# Altium schematic sheet AudioAmplifier.SchDoc
size A3
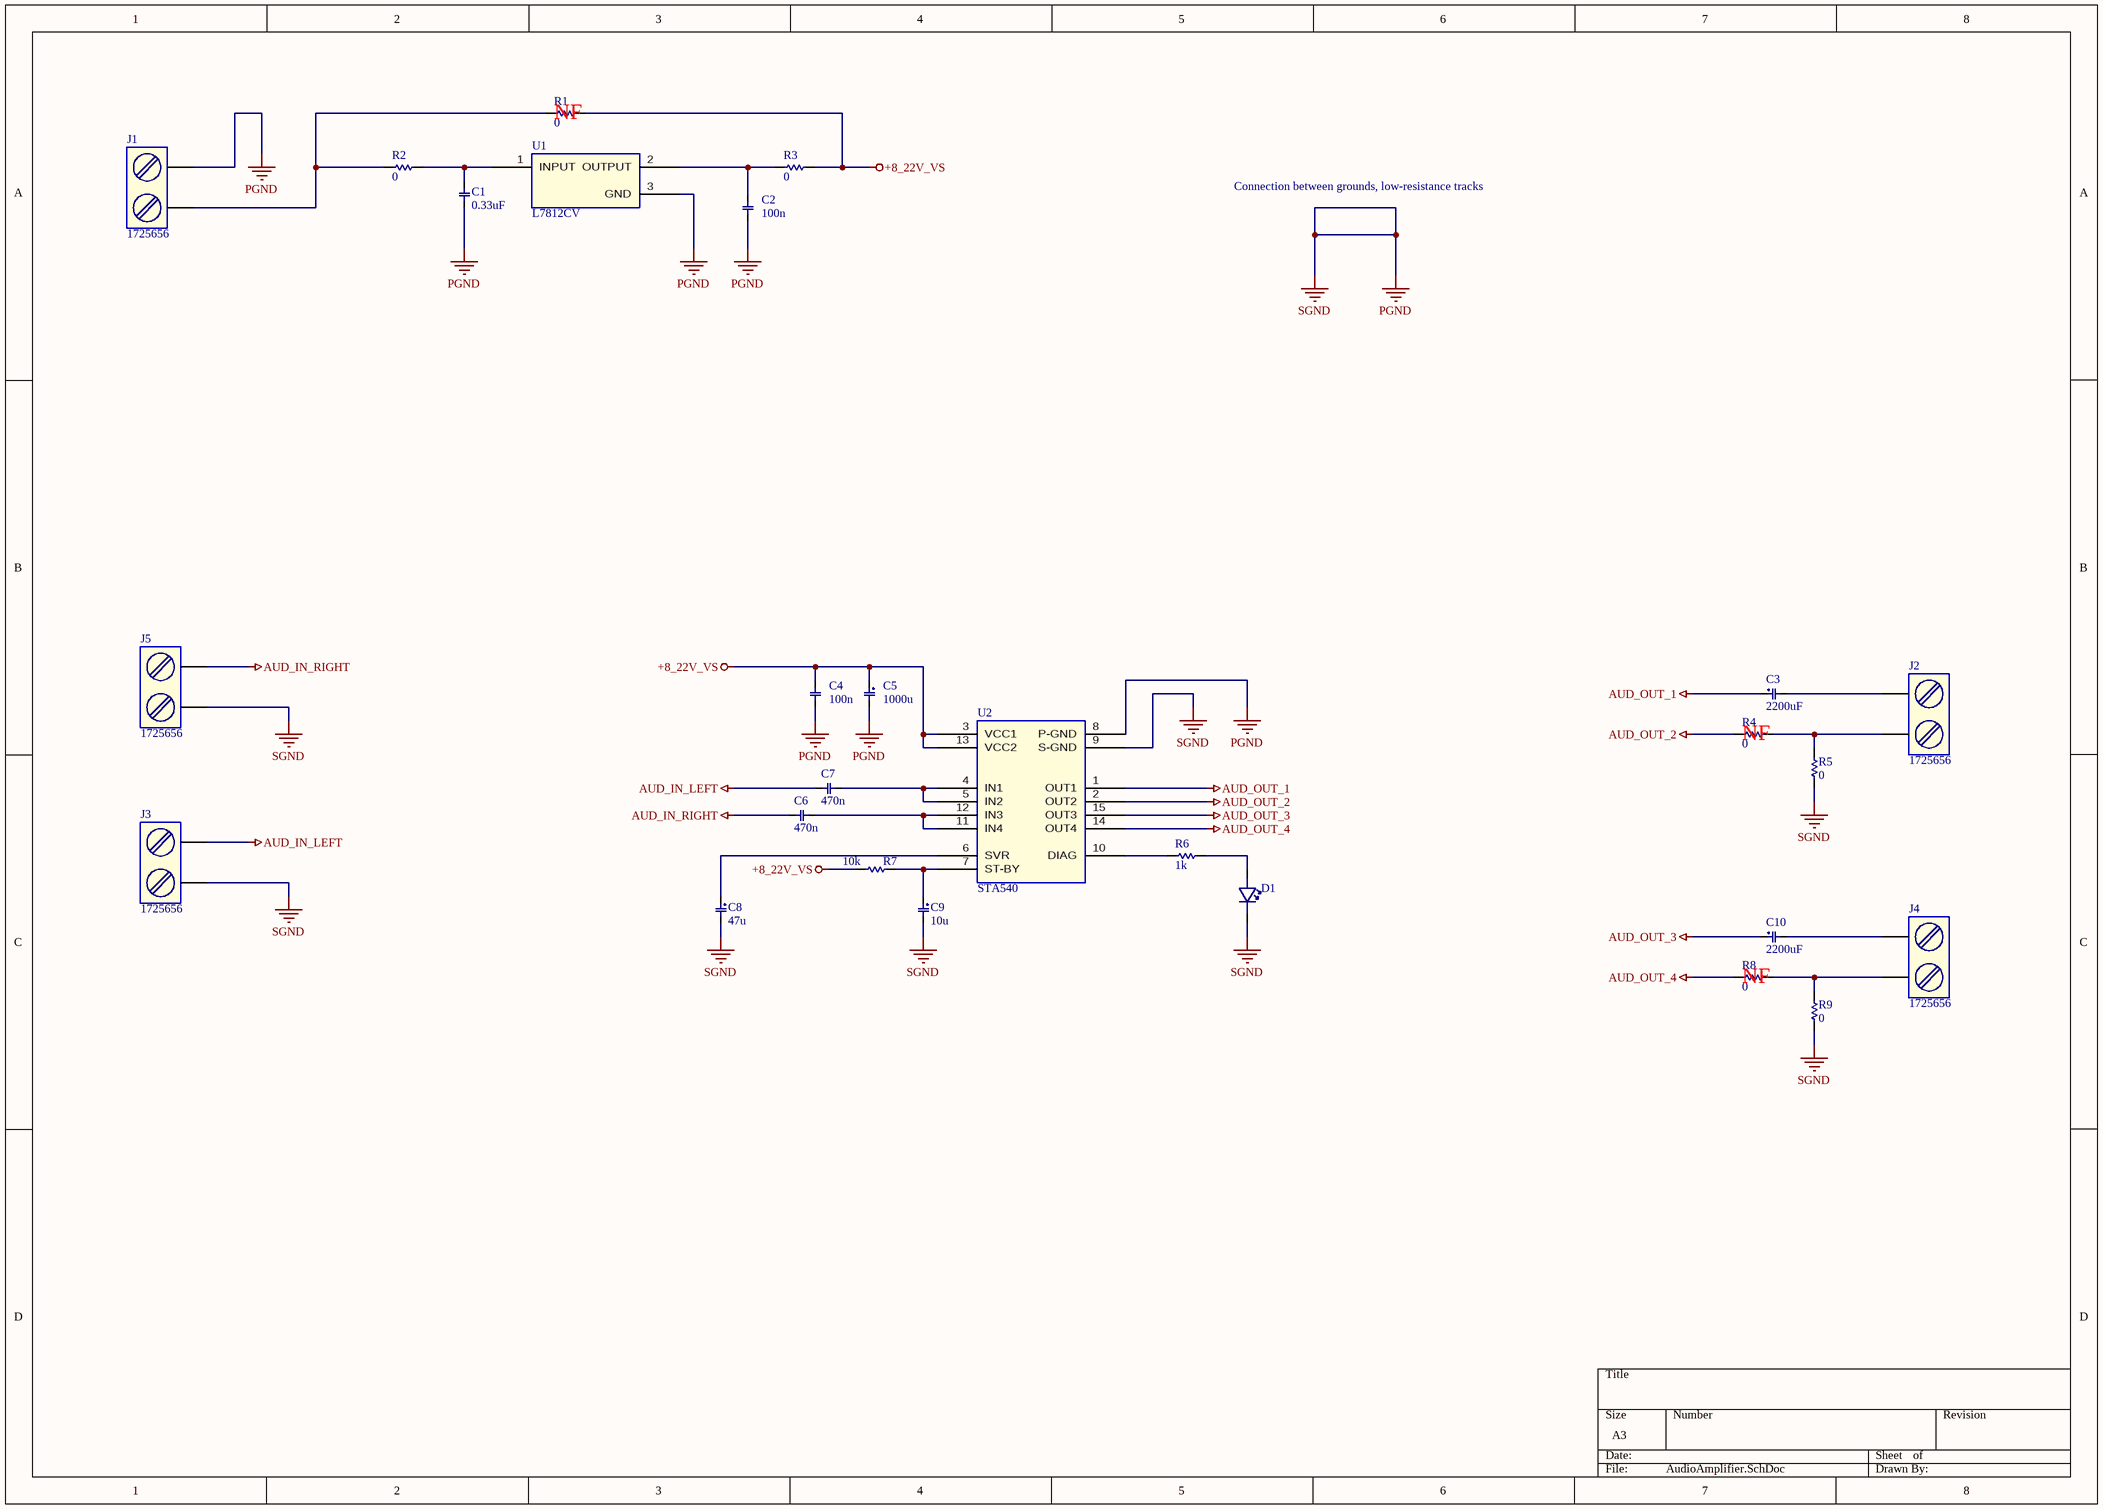
[diagram p0: AudioAmplifier.SchDoc]

## Parts
C1  0.33uF  [CERAMIC CAPACITOR]
C2  100n  [CERAMIC CAPACITOR]
C3  2200uF  [ELECTROLYTIC_CAPACITOR]
C4  100n  [CERAMIC CAPACITOR]
C5  1000u  [ELECTROLYTIC_CAPACITOR]
C6  470n  [CERAMIC CAPACITOR]
C7  470n  [CERAMIC CAPACITOR]
C8  47u  [ELECTROLYTIC_CAPACITOR]
C9  10u  [ELECTROLYTIC_CAPACITOR]
C10  2200uF  [ELECTROLYTIC_CAPACITOR]
D1  350-00006  [LED]  (value not drawn)
J1  1725656  [1725656]
J2  1725656  [1725656]
J3  1725656  [1725656]
J4  1725656  [1725656]
J5  1725656  [1725656]
R1  0  [Resistor]
R2  0  [Resistor]
R3  0  [Resistor]
R4  0  [Resistor]
R5  0  [Resistor]
R6  1k  [Resistor]
R7  10k  [Resistor]
R8  0  [Resistor]
R9  0  [Resistor]
U1  L7812CV  [TO-220]
U2  STA540  [Multiwatt15]

## Nets
+8_22V_VS: C4.1 C5.1 R1.2 R3.2 R7.1 U2.3(VCC1) U2.13(VCC2)
AUD_IN_LEFT: C7.1 J3.2
AUD_IN_RIGHT: C6.1 J5.2
AUD_OUT_1: C3.1 U2.1(OUT1)
AUD_OUT_2: R4.1 U2.2(OUT2)
AUD_OUT_3: C10.1 U2.15(OUT3)
AUD_OUT_4: R8.1 U2.14(OUT4)
PGND: C1.1 C2.2 C4.2 C5.2 C8.2 C9.2 D1.2 J1.2 J3.1 J5.1 R5.1 R9.1 U1.3(GND) U2.8(P-GND) U2.9(S-GND)  [also labelled SGND]
NetC1_2: C1.2 R2.2 U1.1(INPUT)
NetC2_1: C2.1 R3.1 U1.2(OUTPUT)
NetC3_2: C3.2 J2.1
NetC6_2: C6.2 U2.11(IN4) U2.12(IN3)
NetC7_2: C7.2 U2.4(IN1) U2.5(IN2)
NetC8_1: C8.1 U2.6(SVR)
NetC9_1: C9.1 R7.2 U2.7(ST-BY)
NetC10_2: C10.2 J4.1
NetD1_1: D1.1 R6.1
NetJ1_1: J1.1 R1.1 R2.1
NetJ2_2: J2.2 R4.2 R5.2
NetJ4_2: J4.2 R8.2 R9.2
NetR6_2: R6.2 U2.10(DIAG)

## Notes on the sheet
- (near R1) NF
- Connection between grounds, low-resistance tracks
- (near R4) NF
- (near R8) NF

## Library data of the parts
C1 = SR215E334MARTR2: Multilayer Ceramic Capacitors MLCC - Leaded 50volts .33uF 20%; Manufacturer: AVX; Voltage Rating: 50 V; Case Style: Conformally Coated; Case Height: 5.08 mm; Lead Diameter: 0.508 mm; Temperature Coefficient/Code: Z5U; Supplier 1: Mouser; Manufacturer Part Number: SR215E334MARTR2; RoHS: RoHS Compliant; Category: Multilayer Ceramic Capacitors MLCC - Leaded; Stock 1: 0; Pricing 1: 1=0.156, 3000=0.113, 6000=0.099, 15000=0.098, 30000=0.096, 75000=0.093 (EUR); Capacitance: 0.33 uF; Operating Temperature Range: + 10 C to + 85 C; Packaging: Reel; Product: General Type MLCCs; Series: SR21; Termination Style: Radial; Tolerance: 20 %; Voltage Rating DC: 50 V; Brand: AVX; Case Length: 5.08 mm; Case Width: 5.08 mm; Lead Spacing: 5.08 mm; Maximum Operating Temperature: + 85 C; Minimum Operating Temperature: + 10 C; Product Category: Radial Monolithic Capacitors; Standard Pack Qty: 3000; Tradename: SkyCap; RoHS - Mouser: Y; Minimum Order Quantity: 1; Reeling: True; ComponentLink1URL: http://www.avx.com/docs/Catalogs/skycap-sr.pdf; ComponentLink1Description: http://www.avx.com/docs/Catalogs/skycap-sr.pdf
C2 C4 = K104K15X7RF5UH5: Multilayer Ceramic Capacitors MLCC - Leaded .1uF 50volts 10% 5.0mm X7R; Manufacturer: Vishay / BC Components; Capacitance: 0.1 uF; Voltage Rating: 50 V; Case Style: Dipped; Case Width: 2.5 mm; Product Status: New at Mouser; Supplier 1: Mouser; Manufacturer Part Number: K104K15X7RF5UH5; RoHS: RoHS Compliant; Category: Multilayer Ceramic Capacitors MLCC - Leaded; Stock 1: 9873; Pricing 1: 1=0.035, 1000=0.026, 2500=0.026 (EUR); Operating Temperature Range: - 55 C to + 125 C; Packaging: Ammo Pack; Product: General Type MLCCs; Termination Style: Radial; Tolerance: 10 %; Voltage Rating DC: 50 V; Brand: Vishay / BC Components; Maximum Operating Temperature: + 125 C; Minimum Operating Temperature: - 55 C; Product Category: Dipped Radial Ceramic Capacitor; Standard Pack Qty: 2500; RoHS - Mouser: Y; Minimum Order Quantity: 1; Reeling: False; ComponentLink1URL: http://www.mouser.com/ds/2/427/mkseries-205465.pdf; ComponentLink1Description: http://www.mouser.com/ds/2/427/mkseries-205465.pdf
C3 C10 = UVK1H222MHD: Aluminium Electrolytic Capacitors - Leaded 50volts 2200uF 16x31.5 20% 7.5LS; Manufacturer: Nichicon; Voltage Rating DC: 50 V; Leakage Current: 3300 uA; Case Diameter: 16 mm; Case Length: 31.5 mm; Dissipation Factor DF: 0.12; Load Life: 2000 h; Ripple Current: 1980 mA; Supplier 1: Mouser; Manufacturer Part Number: UVK1H222MHD; RoHS: RoHS Compliant; Category: Aluminium Electrolytic Capacitors - Leaded; Stock 1: 25; Pricing 1: 1=1.10, 100=0.819, 500=0.728, 1000=0.638, 2500=0.614 (EUR); Capacitance: 2200 uF; Dimensions: 16 mm Dia. x 31.5 mm L; Packaging: Bulk; Product: General Purpose Electrolytic Capacitors; Series: VK; Termination Style: Radial; Tolerance: 20 %; Brand: Nichicon; Lead Spacing: 7.5 mm; Lead Style: Straight; Maximum Operating Temperature: + 85 C; Product Category: Radial Aluminum Electrolytic Capacitors; Standard Pack Qty: 50; RoHS - Mouser: Y; Minimum Order Quantity: 1; Reeling: False; ComponentLink1URL: http://www.mouser.com/ds/2/293/e-vk-16658.pdf; ComponentLink1Description: http://www.mouser.com/ds/2/293/e-vk-16658.pdf
C5 = UVR1E102MPD1TD: Aluminium Electrolytic Capacitors - Leaded 1000uF 25V 85c; Manufacturer: Nichicon; Tolerance: 20 %; Leakage Current: 750 uA; Case Diameter: 10 mm; Case Length: 20 mm; Dissipation Factor DF: 0.16; Load Life: 2000 h; Ripple Current: 960 mA; Supplier 1: Mouser; Manufacturer Part Number: UVR1E102MPD1TD; RoHS: RoHS Compliant; Category: Aluminium Electrolytic Capacitors - Leaded; Stock 1: 2663; Pricing 1: 1=0.268, 500=0.133, 1000=0.113, 1500=0.108, 2000=0.087 (EUR); Capacitance: 1000 uF; Dimensions: 10 mm Dia. x 20 mm L; Packaging: Reel; Product: General Purpose Electrolytic Capacitors; Series: VR; Termination Style: Radial; Voltage Rating DC: 25 V; Brand: Nichicon; Lead Spacing: 5 mm; Maximum Operating Temperature: + 85 C; Product Category: Radial Aluminum Electrolytic Capacitors; Standard Pack Qty: 500; RoHS - Mouser: Y; Minimum Order Quantity: 1; Reeling: True; ComponentLink1URL: http://nichicon-us.com/english/products/pdfs/e-vr.pdf; ComponentLink1Description: http://nichicon-us.com/english/products/pdfs/e-vr.pdf
C6 C7 = FK28X5R1E474K: Multilayer Ceramic Capacitors MLCC - Leaded 0.47uF 25volts X5R +/-10%; Manufacturer: TDK; Tolerance: 10 %; Type: Dipped Radial Lead Commercial Grade; Voltage Rating: 25 V; Case Style: Dipped; Case Height: 2.5 mm; Case Length: 4 mm; Case Width: 5.5 mm; Lead Diameter: 0.5 mm; Supplier 1: Mouser; Manufacturer Part Number: FK28X5R1E474K; RoHS: RoHS Compliant; Category: Multilayer Ceramic Capacitors MLCC - Leaded; Stock 1: 2394; Pricing 1: 1=0.242, 10=0.168, 100=0.076, 1000=0.064, 2000=0.057, 10000=0.054, 24000=0.050, 50000=0.045, 100000=0.044 (EUR); Capacitance: 0.47 uF; Operating Temperature Range: - 55 C to + 85 C; Packaging: Bulk; Product: General Type MLCCs; Series: FK; Termination Style: Radial; Voltage Rating DC: 25 V; Brand: TDK; Lead Spacing: 5 mm; Maximum Operating Temperature: + 85 C; Minimum Operating Temperature: - 55 C; Standard Pack Qty: 500; Temperature Coefficient/Code: X5R; RoHS - Mouser: Y; Minimum Order Quantity: 1; Reeling: False; ComponentLink1URL: http://www.mouser.com/ds/2/400/tdk_lowvoltageleadmlcc_commercial_general_en-347111.pdf; ComponentLink1Description: http://www.mouser.com/ds/2/400/tdk_lowvoltageleadmlcc_commercial_general_en-347111.pdf
C8 = RGA470M1VBK-0611G: Aluminium Electrolytic Capacitors - Leaded 35V 47uF 105C 6.3x11mm; Manufacturer: Lelon; Tolerance: 20 %; Type: Aluminum Electrolytic Capacitor; Leakage Current: 3 uA; Case Diameter: 6.3 mm; Case Length: 11 mm; Dissipation Factor DF: 0.12; Load Life: 2000 h; Ripple Current: 110 mA; Supplier 1: Mouser; Manufacturer Part Number: RGA470M1VBK-0611G; RoHS: RoHS Compliant; Category: Aluminium Electrolytic Capacitors - Leaded; Stock 1: 9597; Pricing 1: 1=0.078, 10=0.072, 100=0.059, 500=0.046, 1000=0.042, 2000=0.036, 5000=0.030, 10000=0.028, 25000=0.024 (EUR); Capacitance: 47 uF; Dimensions: 6.3 mm Dia. x 11 mm L; Packaging: Bulk; Product: General Purpose Electrolytic Capacitors; Series: RGA; Termination Style: Radial; Voltage Rating DC: 35 V; Brand: Lelon; Lead Spacing: 2.5 mm; Lead Style: Straight; Maximum Operating Temperature: + 105 C; Product Category: Hi-Temp Radial Electrolytic Capacitors; Standard Pack Qty: 500; RoHS - Mouser: Y; Minimum Order Quantity: 1; Reeling: False; ComponentLink1URL: http://www.lelon.com.tw/down.php?f=%2Ffile%2F22.pdf&n=P66-P68%20RGA.pdf; ComponentLink1Description: http://www.lelon.com.tw/down.php?f=%2Ffile%2F22.pdf&n=P66-P68%20RGA.pdf
C9 = REA100M1HBK-0511P: Aluminium Electrolytic Capacitors - Leaded 50V 10uF 20% 5x11mm; Manufacturer: Lelon; Case Diameter: 5 mm; Case Length: 11 mm; Dissipation Factor DF: 0.1; Load Life: 2000 h; Ripple Current: 65 mA; Supplier 1: Mouser; Manufacturer Part Number: REA100M1HBK-0511P; RoHS: RoHS Compliant; Category: Aluminium Electrolytic Capacitors - Leaded; Stock 1: 36441; Pricing 1: 1=0.069, 10=0.067, 100=0.059, 500=0.044, 1000=0.042, 2000=0.035, 5000=0.030, 10000=0.027, 25000=0.018 (EUR); Capacitance: 10 uF; Dimensions: 5 mm Dia. x 11 mm L; Product: General Purpose Electrolytic Capacitors; Series: REA; Termination Style: Radial; Tolerance: 20 %; Voltage Rating DC: 50 V; Brand: Lelon; Lead Spacing: 2 mm; Maximum Operating Temperature: + 85 C; Product Category: Radial Electrolytic Capacitors; Standard Pack Qty: 500; RoHS - Mouser: Y; Minimum Order Quantity: 1; Reeling: False; ComponentLink1URL: http://www.mouser.com/ds/2/231/lelon_REA[1]-341020.pdf; ComponentLink1Description: http://www.mouser.com/ds/2/231/lelon_REA[1]-341020.pdf
D1 = 350-00006: Standard LEDs - Through Hole Red LED; Manufacturer: Parallax; Lens Colour/Style: Diffused; Type: Light Emitting Diode; LED Size: T-1 3/4; Lens Shape: Dome; Supplier 1: Mouser; Manufacturer Part Number: 350-00006; RoHS: RoHS Compliant; Category: Standard LEDs - Through Hole; Stock 1: 106; Pricing 1: 1=0.433 (EUR); Illumination Colour: Red; Brand: Parallax; Forward Current: -; Forward Voltage: -; Luminous Intensity: -; Mounting Style: Through Hole; Viewing Angle: -; Lens Dimensions: 5 mm; Maximum Operating Temperature: -; Minimum Operating Temperature: -; Product Category: Basic Stamp Accessories; Wavelength/Colour Temperature: -; RoHS - Mouser: Y; Minimum Order Quantity: 1; Reeling: False
J1-J5 = 1725656: Fixed Terminal Blocks 2P 2.54mm 90DEG; Manufacturer: Phoenix Contact; Connection Method: Screw; Current Rating: 6 A; Number of Positions: 2; Voltage Rating: 160 V; Wire Gauge Range: 26-20; Wire Orientation: Straight; Wire Gauge Max: 20; Wire Gauge Min: 26; Supplier 1: Mouser; Manufacturer Part Number: 1725656; RoHS: RoHS Compliant; Category: Fixed Terminal Blocks; Stock 1: 8988; Pricing 1: 1=1.25, 10=1.20, 50=1.15, 100=1.12, 250=1.05, 500=0.960, 1000=0.874, 2500=0.827, 5000=0.776 (EUR); Mounting Angle: 90 deg; Mounting Method: -; Series: MPT; Termination Style: Through Hole; Brand: Phoenix Contact; Flammability Rating: UL 94 V-0; Pitch: 2.54 mm; Product Category: PCB Terminal Blocks; Standard Pack Qty: 50; Tradename: COMBICON Control; RoHS - Mouser: Y; Minimum Order Quantity: 1; Reeling: False; ComponentLink1URL: http://www.phoenixcontact.com/us/products/1725656/pdf; ComponentLink1Description: http://www.phoenixcontact.com/us/products/1725656/pdf
R1-R5 R8 R9 = SFR25000Z0000ZR500: Metal Film Resistors - Through Hole 400mW 0 Ohm Jumper SFR55 Historical p/n; Manufacturer: Vishay / BC Components; Resistance: 0 Ohms; Case Diameter: 2.5 mm; Case Length: 6.5 mm; Lead Diameter: 0.58 mm; Supplier 1: Mouser; Manufacturer Part Number: SFR25000Z0000ZR500; RoHS: RoHS Compliant; Category: Metal Film Resistors - Through Hole; Stock 1: 18754; Pricing 1: 1=0.095, 50=0.067, 100=0.048, 1000=0.029, 5000=0.023, 10000=0.019, 20000=0.014, 30000=0.013, 50000=0.012 (EUR); Operating Temperature Range: - 55 C to + 155 C; Package/Case: 0207; Packaging: Reel; Power Rating: -; Product: Metal Film Resistors Zero-Ohm; Series: SFR16S/25/25H; Temperature Coefficient: -; Termination Style: Axial; Tolerance: -; Type: Standard Metal Film Leaded Resistors; Voltage Rating: -; Brand: Vishay / BC Components; Product Category: Metal Film Resistors; RoHS - Mouser: Y; Minimum Order Quantity: 1; Reeling: True; ComponentLink1URL: http://www.vishay.com/doc?28722; ComponentLink1Description: http://www.vishay.com/doc?28722
R6 = MFS1/2DCT52R1001F: Metal Film Resistors - Through Hole 1/2W1K ohm 1%; Manufacturer: KOA Speer; Power Rating: 500 mW (1/2 W); Resistance: 1 kOhms; Temperature Coefficient: 100 PPM / C; Case Diameter: 2.3 mm; Case Length: 6.3 mm; Supplier 1: Mouser; Manufacturer Part Number: MFS1/2DCT52R1001F; RoHS: RoHS Compliant; Category: Metal Film Resistors - Through Hole; Stock 1: 7805; Pricing 1: 1=0.087, 5000=0.056, 10000=0.053, 50000=0.049, 100000=0.046 (EUR); Operating Temperature Range: - 55 C to + 155 C; Packaging: Reel; Product: Metal Film Resistors General Purpose; Series: MF; Termination Style: Axial; Tolerance: 1 %; Type: Semi-precision metal film resistors; Brand: KOA Speer; Lead Spacing: 30 mm; Product Category: 1/2Watt Metal Film Resistors; Standard Pack Qty: 5000; RoHS - Mouser: Y; Minimum Order Quantity: 1; Reeling: True; ComponentLink1URL: http://www.koaspeer.com/catimages/Products/MF-MFS-RK/MF-MFS-RK.pdf; ComponentLink1Description: http://www.koaspeer.com/catimages/Products/MF-MFS-RK/MF-MFS-RK.pdf
R7 = SFR16S0001002FR500: Metal Film Resistors - Through Hole 1/2watt 10Kohms 1%; Manufacturer: Vishay / BC Components; Power Rating: 500 mW (1/2 W); Temperature Coefficient: 100 PPM / K; Voltage Rating: 200 V; Case Diameter: 1.9 mm; Case Length: 4.1 mm; Lead Diameter: 0.45 mm; Product Status: New at Mouser; Supplier 1: Mouser; Manufacturer Part Number: SFR16S0001002FR500; RoHS: RoHS Compliant; Category: Metal Film Resistors - Through Hole; Stock 1: 0; Pricing 1: 1=0.087, 50=0.048, 100=0.043, 500=0.029, 1000=0.019, 5000=0.019 (EUR); Operating Temperature Range: - 55 C to + 155 C; Packaging: Reel; Product: Metal Film Resistors General Purpose; Resistance: 10 kOhms; Series: SFR16S; Termination Style: Axial; Tolerance: 1 %; Type: Standard Metal Film Leaded Resistors; Brand: Vishay / BC Components; Product Category: Metal Film Resistors; RoHS - Mouser: Y; Minimum Order Quantity: 1; Reeling: True; ComponentLink1URL: http://www.vishay.com/doc?28722; ComponentLink1Description: http://www.vishay.com/doc?28722
U1 = L7812CV: Linear Voltage Regulators 12V 1.5A Positive; Manufacturer: STMicroelectronics; Input Voltage MAX: 35 V; Number of Outputs: 1; Output Type: Fixed; PSRR / Ripple Rejection - Typ: 55 dB; Input Voltage MIN: 14 V; Line Regulation: 240 mV; Supplier 1: Mouser; Manufacturer Part Number: L7812CV; RoHS: RoHS Compliant; Category: Linear Voltage Regulators; Stock 1: 11850; Pricing 1: 1=0.562, 10=0.376, 100=0.249, 1000=0.193, 2500=0.163, 10000=0.157, 25000=0.148, 50000=0.145 (EUR); Output Current: 1.5 A; Output Voltage: 12 V; Package/Case: TO-220; Packaging: Tube; Series: L7812; Brand: STMicroelectronics; Mounting Style: Through Hole; Load Regulation: 240 mV; Maximum Operating Temperature: + 125 C; Minimum Operating Temperature: 0 C; Polarity: Positive; Product Category: Voltage Regulators; Standard Pack Qty: 1000; RoHS - Mouser: Y; Minimum Order Quantity: 1; Reeling: False; ComponentLink1URL: http://www.st.com/web/en/resource/technical/document/datasheet/CD00000444.pdf; ComponentLink1Description: http://www.st.com/web/en/resource/technical/document/datasheet/CD00000444.pdf
U2 = STA540: Audio Amplifiers 4-CH AB Audio AMP 4 X 13 W Dual/Quad; Manufacturer: STMicroelectronics; Output Power: 34 W; Supply Type: Single; Gain: 26 dB; THD plus Noise: 0.02 %; Audio Load Resistance: 8 Ohms; Class: Class-AB; Operating Supply Voltage: 9 V, 12 V, 15 V, 18 V; Output Signal Type: Differential, Single; Pd - Power Dissipation: 36000 mW; Supply Voltage - Max: 22 V; Supply Voltage - Min: 8 V; Supplier 1: Mouser; Manufacturer Part Number: STA540; RoHS: RoHS Compliant; Category: Audio Amplifiers; Stock 1: 946; Pricing 1: 1=4.09, 10=3.30, 100=2.92, 250=2.70, 500=2.43, 1000=2.05, 2500=1.95, 5000=1.87 (EUR); Package/Case: MULTIWATT V; Packaging: Tube; Product: Audio Amplifiers; Series: STA540; Type: 1-Channel Mono or 2-Channel Stereo or 4-Channel Stereo; Brand: STMicroelectronics; Mounting Style: Through Hole; Input Signal Type: Single; Maximum Operating Temperature: + 70 C; Minimum Operating Temperature: 0 C; Product Category: Audio Integrated Circuits; Standard Pack Qty: 25; RoHS - Mouser: Y; Minimum Order Quantity: 1; Reeling: False; ComponentLink1URL: http://www.st.com/web/en/resource/technical/document/datasheet/CD00171346.pdf; ComponentLink1Description: http://www.st.com/web/en/resource/technical/document/datasheet/CD00171346.pdf